# Altium schematic sheet Main.SchDoc
size A4; SheetNumber: 2; SheetTotal: 6
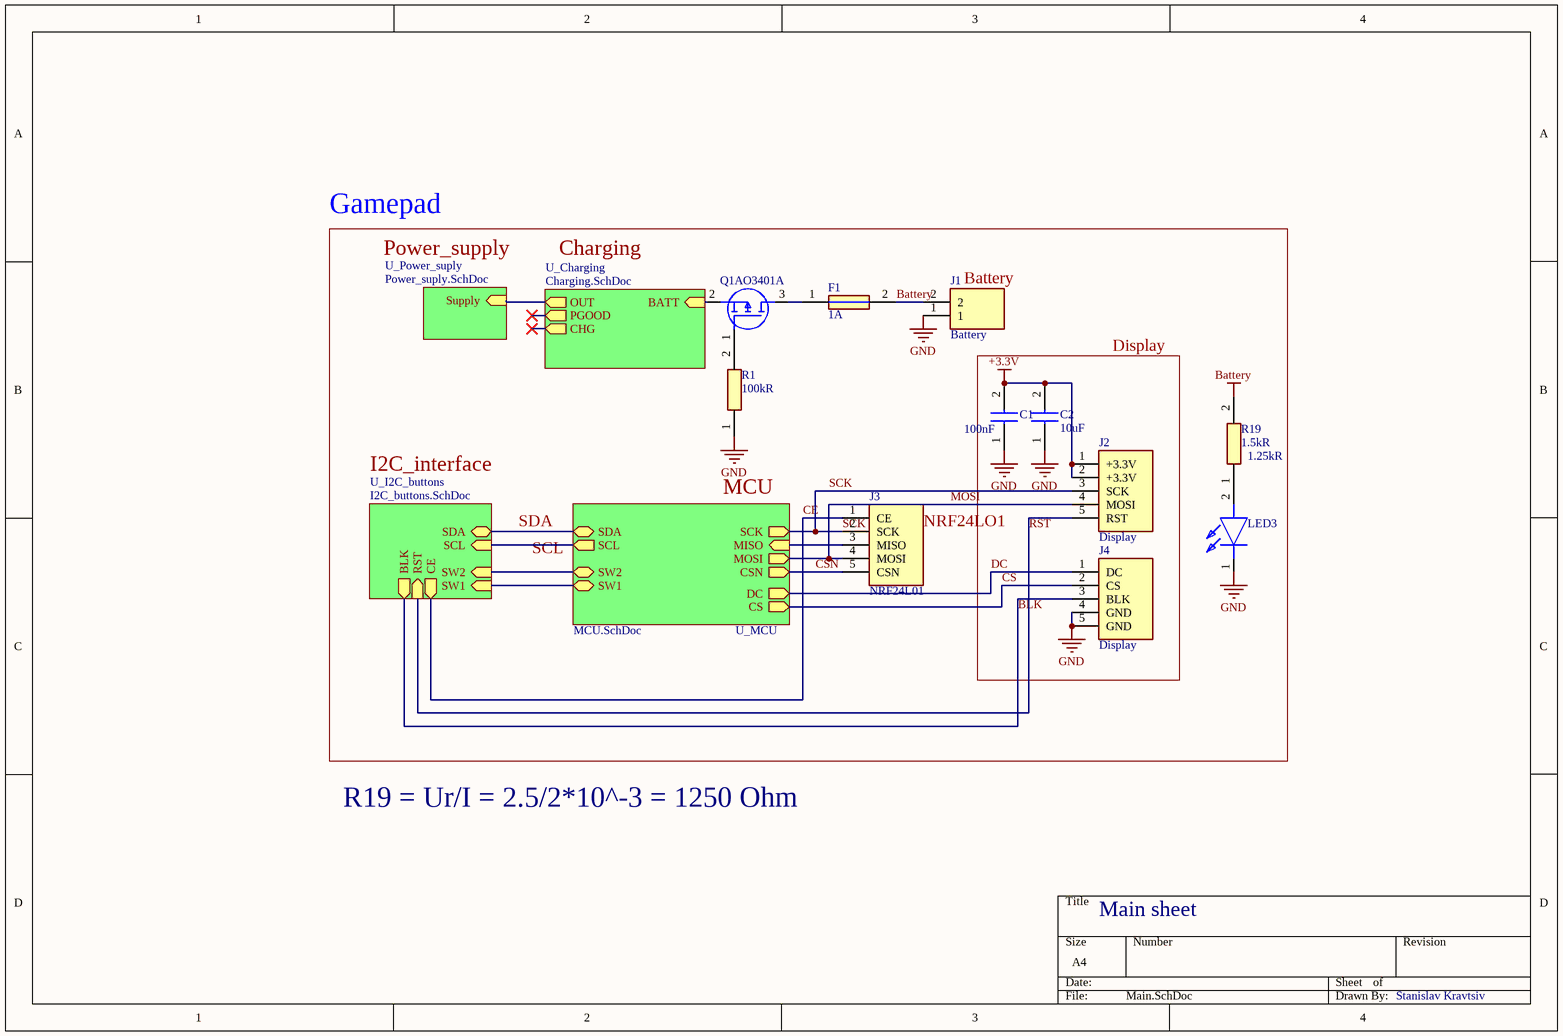
[diagram p0: Main.SchDoc]

## Parts
C1  100nF  [CAPC1608X95N]
C2  10uF  [CAPC2012X140N]
F1  1А  [FUSC6125X279N]
J1  Battery  [Conector_2]
J2  Display  [1.25_JSH-GH_5]
J3  NRF24L01  [1.25_JSH-GH_5]
J4  Display  [1.25_JSH-GH_5]
LED3  LS_L29K-H1J2-1  [SMT-0603]  (value not drawn)
Q1  AO3401A  [SOT95P280X125-3N]
R1  100kR  [RESC1608X55N]
R19  1.5kR  [RESC1608X55N]

## Blocks framed on the sheet
Gamepad: F1 J1 J3 LED3 Q1 R1 R19
Display: C1 C2 J2 J4

## Sub-sheets
U_Charging = Charging.SchDoc: BATT (in), OUT (out), PGOOD (out), CHG (out)
U_I2C_buttons = I2C_buttons.SchDoc: CE (out), RST (in), BLK (out), SDA (bidir), SCL (in), SW2 (in), SW1 (in)
U_MCU = MCU.SchDoc: DC (out), CS (out), SDA (bidir), SCL (out), SW2 (bidir), SW1 (bidir), CSN (out), MOSI (out), MISO (in), SCK (out)
U_Power_suply = Power_suply.SchDoc: Supply (in)

## Nets
+3.3V: C1.2 C2.2 J2.1(+3.3V) J2.2(+3.3V)
Battery: F1.2 J1.2 R19.2
GND: C1.1 C2.1 J1.1 J4.4(GND) J4.5(GND) LED3.1(K) R1.1
BLK: J4.3(BLK) ; sheet U_I2C_buttons/BLK
CE: J3.1(CE) ; sheet U_I2C_buttons/CE
CS: J4.2(CS) ; sheet U_MCU/CS
CSN: J3.5(CSN) ; sheet U_MCU/CSN
DC: J4.1(DC) ; sheet U_MCU/DC
MOSI: J2.4(MOSI) J3.4(MOSI) ; sheet U_MCU/MOSI
RST: J2.5(RST) ; sheet U_I2C_buttons/RST
SCK: J2.3(SCK) J3.2(SCK) ; sheet U_MCU/SCK
NetF1_1: F1.1 Q1.3(D)
NetJ3_3: J3.3(MISO) ; sheet U_MCU/MISO
NetLED3_2: LED3.2(A) R19.1
NetQ1_1: Q1.1(G) R1.2
NetQ1_2: Q1.2(S) ; sheet U_Charging/BATT
(unnamed): sheet U_MCU/SDA, sheet U_I2C_buttons/SDA
(unnamed): sheet U_MCU/SCL, sheet U_I2C_buttons/SCL
(unnamed): sheet U_MCU/SW2, sheet U_I2C_buttons/SW2
(unnamed): sheet U_MCU/SW1, sheet U_I2C_buttons/SW1
(unnamed): sheet U_Power_suply/Supply, sheet U_Charging/OUT

## Notes on the sheet
- Power_supply
- Charging
- (near J1) Battery
- I2C_interface
- MCU
- (near R19) 1.25kR
- SDA
- SCL
- NRF24LO1
- R19 = Ur/I = 2.5/2*10^-3 = 1250 Ohm
- Main sheet
- Stanislav Kravtsiv

## Library data of the parts
C1 = 0603B104K500CT: Capacitor; Manufacturer_Name: Walsin Technology Corporation; Datasheet Link: https://datasheet.datasheetarchive.com/originals/distributors/DKDS41/DSANUWW0027552.pdf; Height: 0.95mm; Manufacturer_Part_Number: 0603B104K500CT; Mouser Part Number: 791-0603B104K500CT; Mouser Price/Stock: https://www.mouser.co.uk/ProductDetail/Walsin/0603B104K500CT?qs=fIkAfuXiAQLxgNQoxkAdgw%3D%3D; Arrow Part Number: 0603B104K500CT; Arrow Price/Stock: https://www.arrow.com/en/products/0603b104k500ct/walsin-technology
C2 = CL21B106KPQNNNG: Capacitor; Manufacturer_Name: SAMSUNG; Datasheet Link: https://datasheet.datasheetarchive.com/originals/distributors/Datasheets-DGA8/2485630.pdf; Height: 1.4mm; Manufacturer_Part_Number: CL21B106KPQNNNG; Mouser Part Number: 187-CL21B106KPQNNNG; Mouser Price/Stock: https://www.mouser.co.uk/ProductDetail/Samsung-Electro-Mechanics/CL21B106KPQNNNG?qs=yOVawPpwOwmi1gAJqK4H6Q%3D%3D; Arrow Part Number: CL21B106KPQNNNG; Arrow Price/Stock: https://www.arrow.com/en/products/cl21b106kpqnnng/samsung-electro-mechanics?utm_currency=USD&region=nac
F1 = 0679L2000-01: Fuse; Manufacturer_Name: BelFuse; Datasheet Link: https://componentsearchengine.com/Datasheets/1/0679L2000-01.pdf; Height: 2.79mm; Manufacturer_Part_Number: 0679L2000-01; Mouser Part Number: 530-0679L2000-01; Mouser Price/Stock: https://www.mouser.co.uk/ProductDetail/Bel-Fuse/0679L2000-01?qs=ZqXcJfGlKsicXrgxMSU%252B%2Fw%3D%3D
J1 = B2B-XH-AM_LF__SN_: Connector; Manufacturer_Name: JST (JAPAN SOLDERLESS TERMINALS); Manufacturer_Part_Number: B2B-XH-AM(LF)(SN); Datasheet Link: https://www.jst-mfg.com/product/pdf/eng/eXH.pdf; Height: 7mm; Mouser Part Number: 306-B2B-XH-AMLFSNP; Mouser Price/Stock: https://www.mouser.co.uk/ProductDetail/JST-Commercial/B2B-XH-AMLFSN?qs=cdbOS8ANM9BJgHgwB7WxQw%3D%3D; Arrow Part Number: B2B-XH-AM(LF)(SN); Arrow Price/Stock: https://www.arrow.com/en/products/b2b-xh-am-lf-sn/jst-manufacturing?utm_currency=USD&region=europe
J2-J4 = B5B-XH-AM__LF__SN_: Connector; Manufacturer_Name: JST (JAPAN SOLDERLESS TERMINALS); Manufacturer_Part_Number: B5B-XH-AM (LF)(SN); Datasheet Link: http://uk.rs-online.com/web/p/products/1755317; Height: 7mm; Arrow Part Number: B5B-XH-AM (LF)(SN); Arrow Price/Stock: https://www.arrow.com/en/products/b5b-xh-am-lf-sn/jst-manufacturing
LED3 = LS_L29K-H1J2-1: LED; Manufacturer_Name: ams OSRAM; Manufacturer_Part_Number: LS L29K-H1J2-1; Mouser Part Number: 720-LSL29K-H1J2-1-Z; Mouser Price/Stock: https://www.mouser.com/Search/Refine.aspx?Keyword=720-LSL29K-H1J2-1-Z
Q1 = AO3401A: MOSFET (P-Channel); Manufacturer_Name: Alpha & Omega Semiconductors; Datasheet Link: http://www.aosmd.com/pdfs/datasheet/AO3401A.pdf; Height: 1.25mm; Manufacturer_Part_Number: AO3401A; Arrow Part Number: AO3401A; Arrow Price/Stock: https://www.arrow.com/en/products/ao3401a/alpha-and-omega-semiconductor.html?utm_currency=USD&region=europe
R1 = RC0603FR-07100KL: Resistor; Manufacturer_Name: YAGEO; Datasheet Link: https://www.yageo.com/upload/media/product/productsearch/datasheet/rchip/PYu-RC_Group_51_RoHS_L_12.pdf; Height: 0.55mm; Manufacturer_Part_Number: RC0603FR-07100KL; Mouser Part Number: 603-RC0603FR-07100KL; Mouser Price/Stock: https://www.mouser.co.uk/ProductDetail/YAGEO/RC0603FR-07100KL?qs=e1ok2LiJcmaihem8Va5%2Fsw%3D%3D; Arrow Part Number: RC0603FR-07100KL; Arrow Price/Stock: https://www.arrow.com/en/products/rc0603fr-07100kl/yageo?utm_currency=USD&region=europe
R19 = RC0603FR-071K5L: Resistor; Manufacturer_Name: Yageo Group; Datasheet Link: https://www.yageo.com/upload/media/product/productsearch/datasheet/rchip/PYu-RC_Group_51_RoHS_L_12.pdf; Height: 0.55mm; Manufacturer_Part_Number: RC0603FR-071K5L; Mouser Part Number: 603-RC0603FR-071K5L; Mouser Price/Stock: https://www.mouser.co.uk/ProductDetail/YAGEO/RC0603FR-071K5L?qs=VU8sRB4EgwBMt9nc4XGNgA%3D%3D; Arrow Part Number: RC0603FR-071K5L; Arrow Price/Stock: https://www.arrow.com/en/products/rc0603fr-071k5l/yageo?utm_currency=USD&region=europe